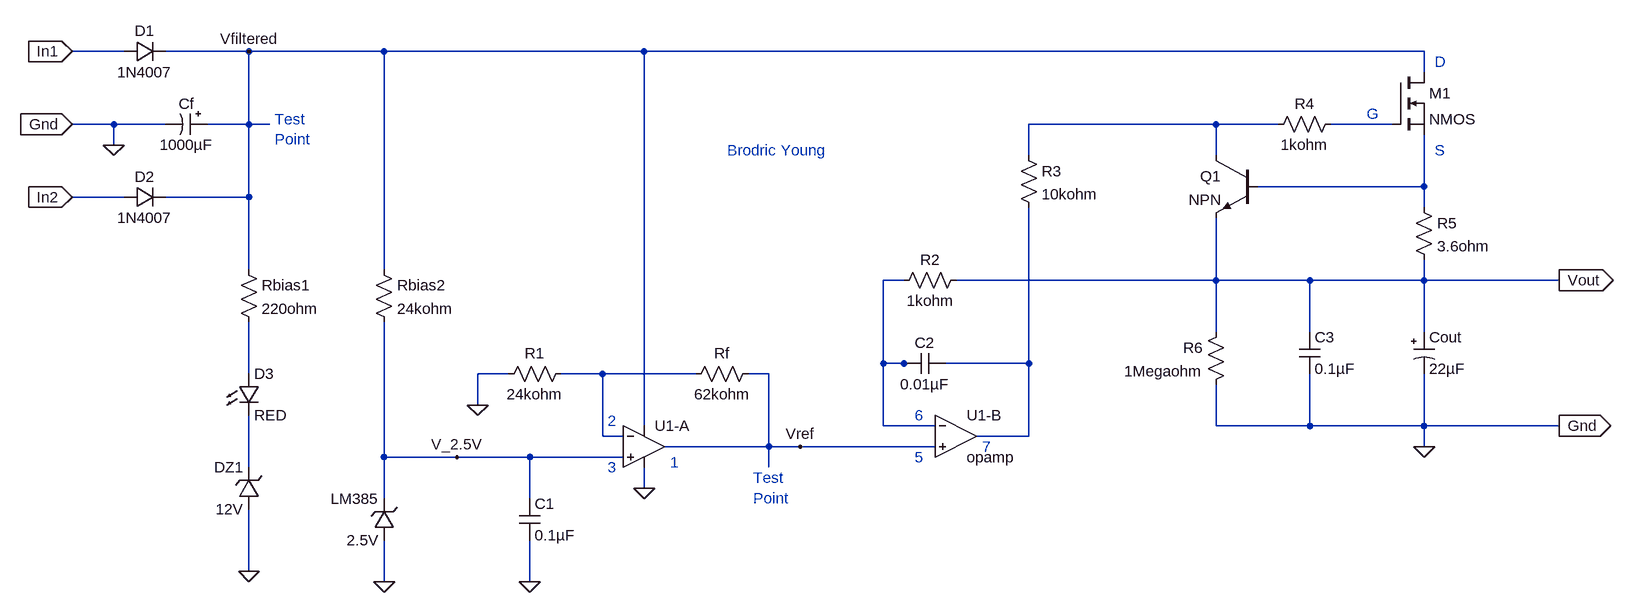
[diagram p0: schematic Schematic.asc]
Schematic.asc, the LTspice schematic file:
Version 4
SHEET 1 2480 948
WIRE 160 112 80 112
WIRE 352 112 224 112
WIRE 560 112 352 112
WIRE 960 112 560 112
WIRE 2160 112 960 112
WIRE 2160 144 2160 112
WIRE 144 224 80 224
WIRE 224 224 144 224
WIRE 352 224 352 112
WIRE 352 224 288 224
WIRE 384 224 352 224
WIRE 1840 224 1552 224
WIRE 1936 224 1840 224
WIRE 2112 224 2016 224
WIRE 144 256 144 224
WIRE 1552 272 1552 224
WIRE 1840 272 1840 224
WIRE 2160 320 2160 240
WIRE 2160 320 1904 320
WIRE 160 336 80 336
WIRE 352 336 352 224
WIRE 352 336 224 336
WIRE 2160 352 2160 320
WIRE 352 448 352 336
WIRE 560 448 560 112
WIRE 1360 464 1328 464
WIRE 1840 464 1840 368
WIRE 1840 464 1440 464
WIRE 1984 464 1840 464
WIRE 2160 464 2160 432
WIRE 2160 464 1984 464
WIRE 2368 464 2160 464
WIRE 1840 544 1840 464
WIRE 1984 544 1984 464
WIRE 2160 544 2160 464
WIRE 1328 592 1328 464
WIRE 1360 592 1328 592
WIRE 1376 592 1360 592
WIRE 1552 592 1552 352
WIRE 1552 592 1424 592
WIRE 352 608 352 528
WIRE 752 608 704 608
WIRE 896 608 832 608
WIRE 1040 608 896 608
WIRE 1152 608 1120 608
WIRE 704 656 704 608
WIRE 960 688 960 112
WIRE 1328 688 1328 592
WIRE 1408 688 1328 688
WIRE 1840 688 1840 624
WIRE 1984 688 1984 608
WIRE 1984 688 1840 688
WIRE 2160 688 2160 608
WIRE 2160 688 1984 688
WIRE 2368 688 2160 688
WIRE 896 704 896 608
WIRE 928 704 896 704
WIRE 1552 704 1552 592
WIRE 1552 704 1472 704
WIRE 1152 720 1152 608
WIRE 1152 720 992 720
WIRE 1200 720 1152 720
WIRE 1408 720 1200 720
WIRE 2160 720 2160 688
WIRE 560 736 560 528
WIRE 672 736 560 736
WIRE 784 736 672 736
WIRE 928 736 784 736
WIRE 352 752 352 672
WIRE 1152 752 1152 720
WIRE 960 784 960 752
WIRE 560 800 560 736
WIRE 784 800 784 736
WIRE 352 912 352 816
WIRE 560 928 560 864
WIRE 784 928 784 864
FLAG 80 112 In1
IOPIN 80 112 In
FLAG 80 224 Gnd
IOPIN 80 224 In
FLAG 80 336 In2
IOPIN 80 336 In
FLAG 144 256 0
FLAG 352 912 0
FLAG 704 656 0
FLAG 784 928 0
FLAG 560 928 0
FLAG 960 784 0
FLAG 352 112 Vfiltered
FLAG 672 736 V_2.5V
FLAG 1200 720 Vref
FLAG 2160 720 0
FLAG 2368 464 Vout
IOPIN 2368 464 Out
FLAG 2368 688 Gnd
IOPIN 2368 688 Out
SYMBOL diode 160 128 R270
WINDOW 0 32 32 VTop 2
WINDOW 3 0 32 VBottom 2
SYMATTR InstName D1
SYMATTR Value 1N4007
SYMBOL diode 160 352 R270
WINDOW 0 32 32 VTop 2
WINDOW 3 0 32 VBottom 2
SYMATTR InstName D2
SYMATTR Value 1N4007
SYMBOL polcap 288 208 R90
WINDOW 0 0 32 VBottom 2
WINDOW 3 32 32 VTop 2
SYMATTR InstName Cf
SYMATTR Value 1000µF
SYMBOL res 336 432 R0
SYMATTR InstName Rbias1
SYMATTR Value 220ohm
SYMBOL res 544 432 R0
SYMATTR InstName Rbias2
SYMATTR Value 24kohm
SYMBOL LED 336 608 R0
SYMATTR InstName D3
SYMATTR Value RED
SYMBOL zener 368 816 R180
WINDOW 0 24 64 Left 2
WINDOW 3 24 0 Left 2
SYMATTR InstName DZ1
SYMATTR Value 12V
SYMBOL res 848 592 R90
WINDOW 0 0 56 VBottom 2
WINDOW 3 32 56 VTop 2
SYMATTR InstName R1
SYMATTR Value 24kohm
SYMBOL res 1136 592 R90
WINDOW 0 0 56 VBottom 2
WINDOW 3 32 56 VTop 2
SYMATTR InstName Rf
SYMATTR Value 62kohm
SYMBOL OpAmps\\opamp2 960 656 R0
SYMATTR InstName U1-A
SYMATTR Value ""
SYMBOL cap 768 800 R0
SYMATTR InstName C1
SYMATTR Value 0.1µF
SYMBOL zener 576 864 R180
WINDOW 0 24 64 Left 2
WINDOW 3 24 0 Left 2
SYMATTR InstName LM385
SYMATTR Value 2.5V
SYMBOL cap 1424 576 R90
WINDOW 0 0 32 VBottom 2
WINDOW 3 32 32 VTop 2
SYMATTR InstName C2
SYMATTR Value 0.01µF
SYMBOL res 1456 448 R90
WINDOW 0 0 56 VBottom 2
WINDOW 3 32 56 VTop 2
SYMATTR InstName R2
SYMATTR Value 1kohm
SYMBOL OpAmps\\opamp 1440 640 R0
SYMATTR InstName U1-B
SYMBOL res 1536 256 R0
SYMATTR InstName R3
SYMATTR Value 10kohm
SYMBOL npn 1904 272 M0
SYMATTR InstName Q1
SYMBOL res 2032 208 R90
WINDOW 0 0 56 VBottom 2
WINDOW 3 32 56 VTop 2
SYMATTR InstName R4
SYMATTR Value 1kohm
SYMBOL nmos 2112 144 R0
SYMATTR InstName M1
SYMBOL res 2144 336 R0
SYMATTR InstName R5
SYMATTR Value 3.6ohm
SYMBOL res 1856 528 M0
SYMATTR InstName R6
SYMATTR Value 1Megaohm
SYMBOL cap 1968 544 R0
SYMATTR InstName C3
SYMATTR Value 0.1µF
SYMBOL polcap 2144 544 R0
SYMATTR InstName Cout
SYMATTR Value 22µF
TEXT 392 216 Left 2 ;Test\nPoint
TEXT 1000 744 Left 2 ;1
TEXT 904 680 Left 2 ;2
TEXT 904 752 Left 2 ;3
TEXT 1128 768 Left 2 ;Test\nPoint
TEXT 1480 720 Left 2 ;7
TEXT 1376 672 Left 2 ;6
TEXT 1376 736 Left 2 ;5
TEXT 2176 128 Left 2 ;D
TEXT 2072 208 Left 2 ;G
TEXT 2176 264 Left 2 ;S
TEXT 1088 264 Left 2 ;Brodric Young

The netlist it stands for:
* Schematic.asc
D1 In1 Vfiltered 1N4007
D2 In2 Vfiltered 1N4007
Cf Vfiltered 0 1000µF
Rbias1 Vfiltered N006 220ohm
Rbias2 Vfiltered V_2.5V 24kohm
D3 N006 N008 RED
DZ1 0 N008 12V
R1 N007 0 24kohm
Rf Vref N007 62kohm
XU1-A V_2.5V N007 Vfiltered 0 Vref opamp2  ; pins In+ In- V+ V- OUT
C1 V_2.5V 0 0.1µF
D§LM385 0 V_2.5V 2.5V
C2 N005 N004 0.01µF
R2 Vout N004 1kohm
XU1-B N004 Vref N005 opamp Aol=100K GBW=10Meg  ; pins invin noninvin out
R3 N001 N005 10kohm
Q1 N001 N003 Vout 0 NPN
R4 N002 N001 1kohm
M1 Vfiltered N002 N003 N003 NMOS
R5 N003 Vout 3.6ohm
R6 Vout 0 1Megaohm
C3 Vout 0 0.1µF
Cout Vout 0 22µF
.model D D
.lib standard.dio
.model NPN NPN
.model PNP PNP
.lib standard.bjt
.model NMOS NMOS
.model PMOS PMOS
.lib standard.mos
* Test
* Point
* 1
* 2
* 3
* Test
* Point
* 7
* 6
* 5
* D
* G
* S
* Brodric Young
.backanno
.end